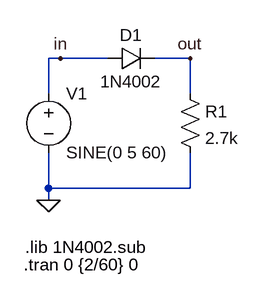
[diagram p0: schematic PreLab2.asc]
PreLab2.asc, the LTspice schematic file:
Version 4
SHEET 1 880 680
WIRE 160 80 144 80
WIRE 224 80 160 80
WIRE 336 80 288 80
WIRE 144 128 144 80
WIRE 336 128 336 80
WIRE 144 256 144 208
WIRE 336 256 336 208
WIRE 336 256 144 256
WIRE 144 272 144 256
FLAG 144 272 0
FLAG 336 80 out
FLAG 160 80 in
SYMBOL voltage 144 112 R0
WINDOW 123 0 0 Left 0
WINDOW 39 0 0 Left 0
SYMATTR InstName V1
SYMATTR Value SINE(0 5 60)
SYMBOL diode 224 96 R270
WINDOW 0 32 32 VTop 2
WINDOW 3 0 32 VBottom 2
SYMATTR InstName D1
SYMATTR Value 1N4002
SYMBOL res 320 112 R0
SYMATTR InstName R1
SYMATTR Value 2.7k
TEXT 110 360 Left 2 !.tran 0 {2/60} 0
TEXT 112 336 Left 2 !.lib 1N4002.sub

The netlist it stands for:
* PreLab2.asc
V1 in 0 SINE(0 5 60)
D1 in out 1N4002
R1 out 0 2.7k
.model D D
.lib standard.dio
.tran 0 {2/60} 0
.lib 1N4002.sub
.backanno
.end

* Results of the author's LTspice run, read from the files saved beside the schematic
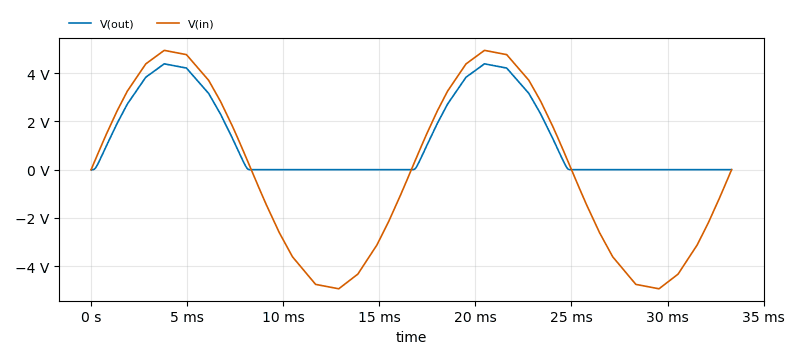
[diagram p1: Transient Analysis of PreLab2.asc, plotted from the saved traces]
* Transient Analysis, 1 run:
*   V(out): min -75.97 µV, max 4.394 V, average 1.32 V, rms 2.139 V, last 50.38 µV
*   V(in): min -4.947 V, max 4.953 V, average 2.169 mV, rms 3.507 V, last 0 V